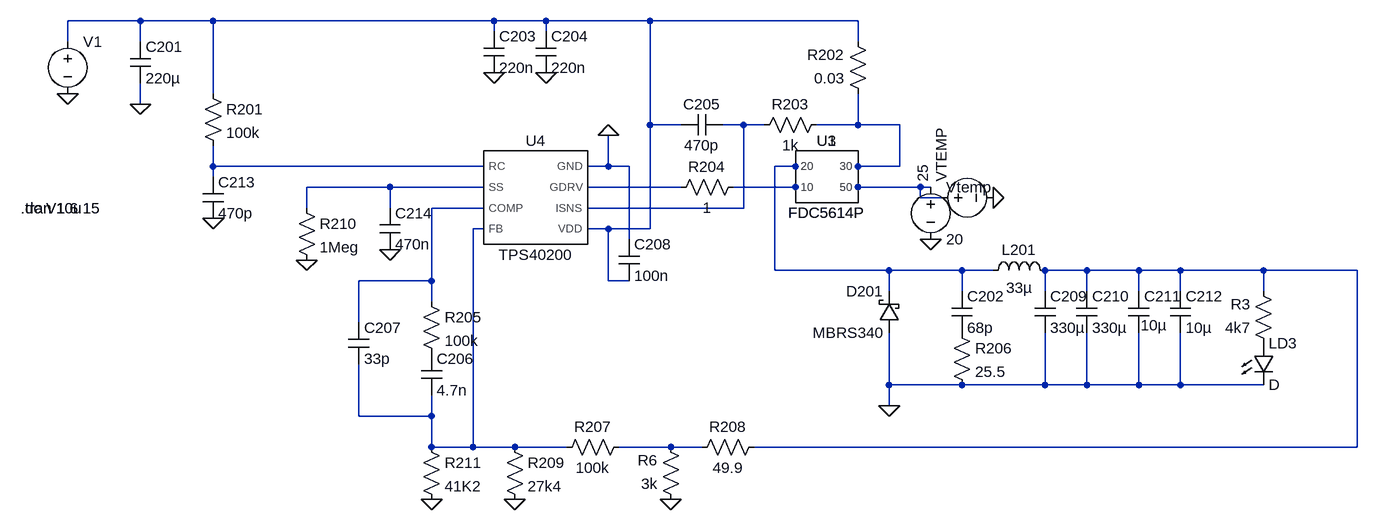
[diagram p0: schematic 12_1_1.asc]
12_1_1.asc, the LTspice schematic file:
Version 4
SHEET 1 1176 708
WIRE -768 -96 -880 -96
WIRE -656 -96 -768 -96
WIRE -224 -96 -656 -96
WIRE -144 -96 -224 -96
WIRE 16 -96 -144 -96
WIRE 336 -96 16 -96
WIRE -224 -80 -224 -96
WIRE -144 -80 -144 -96
WIRE -880 -64 -880 -96
WIRE -768 -64 -768 -96
WIRE 336 -64 336 -96
WIRE -656 16 -656 -96
WIRE -768 32 -768 0
WIRE 16 64 16 -96
WIRE 64 64 16 64
WIRE 160 64 128 64
WIRE 192 64 160 64
WIRE 336 64 336 16
WIRE 336 64 272 64
WIRE 400 64 336 64
WIRE -656 128 -656 96
WIRE -240 128 -656 128
WIRE -48 128 -48 80
WIRE -48 128 -80 128
WIRE -16 128 -48 128
WIRE 240 128 208 128
WIRE 400 128 400 64
WIRE 400 128 336 128
WIRE -656 144 -656 128
WIRE -384 160 -512 160
WIRE -240 160 -384 160
WIRE 64 160 -80 160
WIRE 240 160 144 160
<<<<<<< HEAD
WIRE 448 160 336 160
=======
WIRE 432 160 336 160
WIRE 432 176 432 160
WIRE 464 176 432 176
>>>>>>> 9203fe85b3a3c029a239b3aa033987c992fe23e5
WIRE -512 192 -512 160
WIRE -384 192 -384 160
WIRE -240 192 -320 192
WIRE 160 192 160 64
WIRE 160 192 -80 192
WIRE -240 224 -256 224
WIRE -48 224 -80 224
WIRE 16 224 16 64
WIRE 16 224 -48 224
WIRE -16 240 -16 128
WIRE 208 288 208 128
WIRE 384 288 208 288
WIRE 496 288 384 288
WIRE 544 288 496 288
WIRE 688 288 624 288
WIRE 768 288 688 288
WIRE 832 288 768 288
WIRE 960 288 832 288
WIRE 1104 288 960 288
WIRE -320 304 -320 192
WIRE -320 304 -432 304
WIRE -48 304 -48 224
WIRE -16 304 -48 304
WIRE 384 320 384 288
WIRE 496 320 496 288
WIRE 624 320 624 288
WIRE 688 320 688 288
WIRE 768 320 768 288
WIRE 832 320 832 288
WIRE 960 320 960 288
WIRE -320 336 -320 304
WIRE -432 368 -432 304
WIRE 384 464 384 384
WIRE 496 464 384 464
WIRE 624 464 624 384
WIRE 624 464 496 464
WIRE 688 464 688 384
WIRE 688 464 624 464
WIRE 768 464 768 384
WIRE 768 464 688 464
WIRE 832 464 832 384
WIRE 832 464 768 464
WIRE 960 464 832 464
WIRE 384 496 384 464
WIRE -432 512 -432 432
WIRE -320 512 -320 480
WIRE -320 512 -432 512
WIRE -320 560 -320 512
WIRE -256 560 -256 224
WIRE -256 560 -320 560
WIRE -192 560 -256 560
WIRE -112 560 -192 560
WIRE 48 560 -32 560
WIRE 96 560 48 560
WIRE 1104 560 1104 288
WIRE 1104 560 176 560
FLAG -224 -16 0
FLAG -144 -16 0
FLAG -656 208 0
FLAG -384 256 0
FLAG -512 272 0
FLAG -192 640 0
FLAG 48 640 0
FLAG -768 32 0
FLAG -320 640 0
FLAG -48 80 0
FLAG -880 16 0
FLAG 384 496 0
<<<<<<< HEAD
FLAG 448 240 0
=======
FLAG 544 176 0
>>>>>>> 9203fe85b3a3c029a239b3aa033987c992fe23e5
SYMBOL cap -240 -80 R0
SYMATTR InstName C203
SYMATTR Value 220n
SYMBOL cap -160 -80 R0
SYMATTR InstName C204
SYMATTR Value 220n
SYMBOL res -672 0 R0
SYMATTR InstName R201
SYMATTR Value 100k
SYMBOL cap -672 144 R0
SYMATTR InstName C213
SYMATTR Value 470p
SYMBOL cap -400 192 R0
SYMATTR InstName C214
SYMATTR Value 470n
SYMBOL res -528 176 R0
SYMATTR InstName R210
SYMATTR Value 1Meg
SYMBOL res -336 320 R0
SYMATTR InstName R205
SYMATTR Value 100k
SYMBOL cap -336 416 R0
SYMATTR InstName C206
SYMATTR Value 4.7n
SYMBOL cap -448 368 R0
SYMATTR InstName C207
SYMATTR Value 33p
SYMBOL res -16 544 R90
WINDOW 0 0 56 VBottom 2
WINDOW 3 32 56 VTop 2
SYMATTR InstName R207
SYMATTR Value 100k
SYMBOL res 64 656 R180
WINDOW 0 36 76 Left 2
WINDOW 3 36 40 Left 2
SYMATTR InstName R6
SYMATTR Value 3k
SYMBOL res 80 576 R270
WINDOW 0 32 56 VTop 2
WINDOW 3 0 56 VBottom 2
SYMATTR InstName R208
SYMATTR Value 49.9
SYMBOL cap -784 -64 R0
SYMATTR InstName C201
SYMATTR Value 220µ
SYMBOL voltage -880 -80 R0
WINDOW 123 0 0 Left 0
WINDOW 39 0 0 Left 0
SYMATTR InstName V1
SYMATTR Value ""
SYMBOL res -336 544 R0
SYMATTR InstName R211
SYMATTR Value 41K2
SYMBOL cap 128 48 R90
WINDOW 0 0 32 VBottom 2
WINDOW 3 32 32 VTop 2
SYMATTR InstName C205
SYMATTR Value 470p
SYMBOL res 288 48 R90
WINDOW 0 0 56 VBottom 2
WINDOW 3 32 56 VTop 2
SYMATTR InstName R203
SYMATTR Value 1k
SYMBOL res 352 32 R180
WINDOW 0 36 76 Left 2
WINDOW 3 36 40 Left 2
SYMATTR InstName R202
SYMATTR Value 0.03
SYMBOL res -208 544 R0
SYMATTR InstName R209
SYMATTR Value 27k4
SYMBOL res 160 144 R90
WINDOW 0 0 56 VBottom 2
WINDOW 3 32 56 VTop 2
SYMATTR InstName R204
SYMATTR Value 1
SYMBOL cap -32 240 R0
SYMATTR InstName C208
SYMATTR Value 100n
SYMBOL LED 944 400 R0
SYMATTR InstName LD3
SYMBOL res 976 416 R180
WINDOW 0 36 76 Left 2
WINDOW 3 36 40 Left 2
SYMATTR InstName R3
SYMATTR Value 4k7
SYMBOL cap 816 320 R0
SYMATTR InstName C212
SYMATTR Value 10µ
SYMBOL cap 752 320 R0
WINDOW 3 19 52 Left 2
SYMATTR Value 10µ
SYMATTR InstName C211
SYMBOL cap 672 320 R0
SYMATTR InstName C210
SYMATTR Value 330µ
SYMBOL cap 608 320 R0
SYMATTR InstName C209
SYMATTR Value 330µ
SYMBOL cap 480 320 R0
SYMATTR InstName C202
SYMATTR Value 68p
SYMBOL res 480 368 R0
SYMATTR InstName R206
SYMATTR Value 25.5
SYMBOL schottky 400 384 R180
WINDOW 0 24 64 Left 2
WINDOW 3 24 0 Left 2
SYMATTR InstName D201
SYMATTR Value MBRS340
SYMATTR Description Zener Diode
SYMATTR Type zener
SYMBOL ind 528 304 R270
WINDOW 0 32 56 VTop 2
WINDOW 3 5 56 VBottom 2
SYMATTR InstName L201
SYMATTR Value 33µ
<<<<<<< HEAD
SYMBOL AutoGenerated\\FDC5614P 288 144 R0
SYMATTR InstName U1
SYMBOL voltage 448 144 R0
WINDOW 123 0 0 Left 0
WINDOW 39 0 0 Left 0
SYMATTR InstName Vtemp
SYMATTR Value 20
TEXT -952 192 Left 2 !.dc V1 6 15
=======
SYMBOL FDC5614P 288 144 R0
SYMATTR InstName U3
SYMBOL TPS40200 -160 176 R0
SYMATTR InstName U4
SYMBOL voltage 448 176 R270
WINDOW 123 0 0 Left 0
WINDOW 39 0 0 Left 0
WINDOW 3 24 -12 Left 2
SYMATTR InstName VTEMP
SYMATTR Value 25
TEXT -952 192 Left 2 !.tran 10u
>>>>>>> 9203fe85b3a3c029a239b3aa033987c992fe23e5

The netlist it stands for:
* 12_1_1.asc
C203 N001 0 220n
C204 N001 0 220n
R201 N001 N004 100k
C213 N004 0 470p
C214 N006 0 470n
R210 N006 0 1Meg
R205 N010 P001 100k
C206 P001 N011 4.7n
C207 N010 N011 33p
R207 N013 N011 100k
R6 0 N013 3k
R208 N013 N012 49.9
C201 N001 0 220µ
V1 N001 0
R211 N011 0 41K2
C205 N002 N001 470p
R203 N003 N002 1k
R202 N003 N001 0.03
R209 N011 0 27k4
R204 N008 N007 1
C208 0 N001 100n
D§LD3 P002 0 D
R3 P002 N012 4k7
C212 N012 0 10µ
C211 N012 0 10µ
C210 N012 0 330µ
C209 N012 0 330µ
C202 N005 P003 68p
R206 P003 0 25.5
D201 0 N005 MBRS340
L201 N005 N012 33µ
XU1 N005 N008 N003 N009 FDC5614P  ; pins 20 10 30 50
Vtemp N009 0 20
XU3 N005 N008 N003 N009 FDC5614P  ; pins 20 10 30 50
XU4 N004 N006 N010 N011 0 N007 N002 N001 TPS40200  ; pins RC SS COMP FB GND GDRV ISNS VDD
VTEMP N009 0 25
.model D D
.lib standard.dio
.dc V1 6 15
.tran 10u
.lib FDC5614P.mod
.lib tps40200p.lib
.backanno
.end